# Altium schematic sheet Opamps.SchDoc
size A4; Author: Thomas Kreppel; CompanyName: Universidad de Santiago de Chile; Address1: Avenida Ecuador Nº 3519; Address2: Estación Central, Santiago; Address3: Chile; DocumentNumber: 5; SheetNumber: 5; SheetTotal: 10
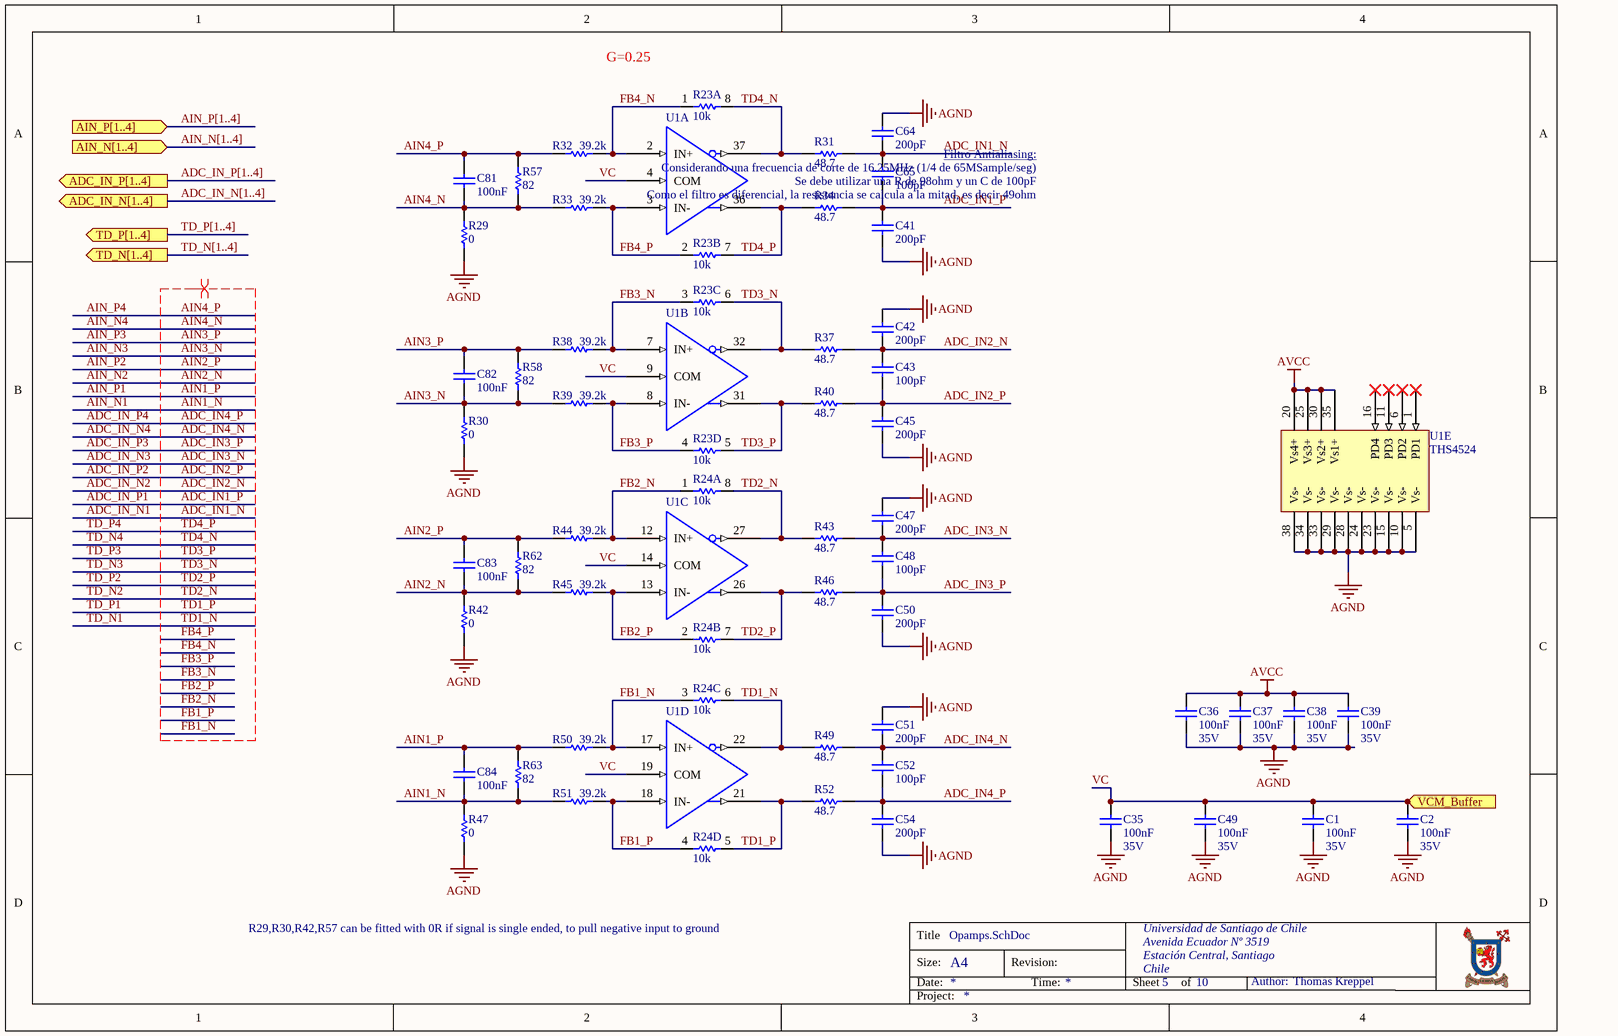
[diagram p0: Opamps.SchDoc]

## Parts
C1  100nF  Voltage: 35V  [CAP_0603]
C2  100nF  Voltage: 35V  [CAP_0603]
C35  100nF  Voltage: 35V  [CAP_0603]
C36  100nF  Voltage: 35V  [CAP_0603]
C37  100nF  Voltage: 35V  [CAP_0603]
C38  100nF  Voltage: 35V  [CAP_0603]
C39  100nF  Voltage: 35V  [CAP_0603]
C41  200pF  [CAP_0603]
C42  200pF  [CAP_0603]
C43  100pF  [CAP_0603]
C45  200pF  [CAP_0603]
C47  200pF  [CAP_0603]
C48  100pF  [CAP_0603]
C49  100nF  Voltage: 35V  [CAP_0603]
C50  200pF  [CAP_0603]
C51  200pF  [CAP_0603]
C52  100pF  [CAP_0603]
C54  200pF  [CAP_0603]
C64  200pF  [CAP_0603]
C65  100pF  [CAP_0603]
C81  100nF  [RES_1206]
C82  100nF  [RES_1206]
C83  100nF  [RES_1206]
C84  100nF  [RES_1206]
R23  10k  [CAC-80P320X160-8N]  (parts A,B,C,D of 4)
R24  10k  [CAC-80P320X160-8N]  (parts A,B,C,D of 4)
R29  0  [RES_0603]
R30  0  [RES_0603]
R31  48.7  [RES_0603]
R32  39.2k  [RES_0603]
R33  39.2k  [RES_0603]
R34  48.7  [RES_0603]
R37  48.7  [RES_0603]
R38  39.2k  [RES_0603]
R39  39.2k  [RES_0603]
R40  48.7  [RES_0603]
R42  0  [RES_0603]
R43  48.7  [RES_0603]
R44  39.2k  [RES_0603]
R45  39.2k  [RES_0603]
R46  48.7  [RES_0603]
R47  0  [RES_0603]
R49  48.7  [RES_0603]
R50  39.2k  [RES_0603]
R51  39.2k  [RES_0603]
R52  48.7  [RES_0603]
R57  82  [RES_1206]
R58  82  [RES_1206]
R62  82  [RES_1206]
R63  82  [RES_1206]
U1  THS4524  [THS4524 Footprint]  (value not drawn)  (parts A,B,C,D,E of 5)

## Ports
ADC_IN_N[1..4] (out), ADC_IN_P[1..4] (out), AIN_N[1..4] (in), AIN_P[1..4] (in), TD_N[1..4] (out), TD_P[1..4] (out), VCM_Buffer (in)

## Nets
AGND: C1.1 C2.1 C35.1 C36.2 C37.2 C38.2 C39.2 C41.2 C42.1 C45.2 C47.1 C49.1 C50.2 C51.1 C54.2 C64.1 R29.2 R30.2 R42.2 R47.2 U1.5(Vs-) U1.10(Vs-) U1.15(Vs-) U1.23(Vs-) U1.24(Vs-) U1.28(Vs-) U1.29(Vs-) U1.33(Vs-) U1.34(Vs-) U1.38(Vs-)
AVCC: C36.1 C37.1 C38.1 C39.1 U1.20(Vs4+) U1.25(Vs3+) U1.30(Vs2+) U1.35(Vs1+)
ADC_IN1_N: C64.2 C65.1 R31.1  [also labelled ADC_IN_N1]
ADC_IN1_P: C41.1 C65.2 R34.1  [also labelled ADC_IN_P1]
ADC_IN2_N: C42.2 C43.1 R37.1  [also labelled ADC_IN_N2]
ADC_IN2_P: C43.2 C45.1 R40.1  [also labelled ADC_IN_P2]
ADC_IN3_N: C47.2 C48.1 R43.1  [also labelled ADC_IN_N3]
ADC_IN3_P: C48.2 C50.1 R46.1  [also labelled ADC_IN_P3]
ADC_IN4_N: C51.2 C52.1 R49.1  [also labelled ADC_IN_N4]
ADC_IN4_P: C52.2 C54.1 R52.1  [also labelled ADC_IN_P4]
AIN1_N: C84.2 R47.1 R51.2 R63.2  [also labelled AIN_N1]
AIN1_P: C84.1 R50.2 R63.1  [also labelled AIN_P1]
AIN2_N: C83.2 R42.1 R45.2 R62.2  [also labelled AIN_N2]
AIN2_P: C83.1 R44.2 R62.1  [also labelled AIN_P2]
AIN3_N: C82.2 R30.1 R39.2 R58.2  [also labelled AIN_N3]
AIN3_P: C82.1 R38.2 R58.1  [also labelled AIN_P3]
AIN4_N: C81.2 R29.1 R33.2 R57.2  [also labelled AIN_N4]
AIN4_P: C81.1 R32.2 R57.1  [also labelled AIN_P4]
FB1_N: R24.3 R50.1 U1.17(IN+)
FB1_P: R24.4 R51.1 U1.18(IN-)
FB2_N: R24.1 R44.1 U1.12(IN+)
FB2_P: R24.2 R45.1 U1.13(IN-)
FB3_N: R23.3 R38.1 U1.7(IN+)
FB3_P: R23.4 R39.1 U1.8(IN-)
FB4_N: R23.1 R32.1 U1.2(IN+)
FB4_P: R23.2 R33.1 U1.3(IN-)
TD1_N: R24.6 R49.2 U1.22(OUT-)  [also labelled TD_N1]
TD1_P: R24.5 R52.2 U1.21(OUT+)  [also labelled TD_P1]
TD2_N: R24.8 R43.2 U1.27(OUT-)  [also labelled TD_N2]
TD2_P: R24.7 R46.2 U1.26(OUT+)  [also labelled TD_P2]
TD3_N: R23.6 R37.2 U1.32(OUT-)  [also labelled TD_N3]
TD3_P: R23.5 R40.2 U1.31(OUT+)  [also labelled TD_P3]
TD4_N: R23.8 R31.2 U1.37(OUT-)  [also labelled TD_N4]
TD4_P: R23.7 R34.2 U1.36(OUT+)  [also labelled TD_P4]
VC: C1.2 C2.2 C35.2 C49.2 U1.4(COM) U1.9(COM) U1.14(COM) U1.19(COM) ; port VCM_Buffer

Not connected (* = marked no-connect by the designer): U1 1(PD1)* 6(PD2)* 11(PD3)* 16(PD4)*

## Buses and harness runs
bus ADC_IN_N[1..4] = port ADC_IN_N[1..4]
bus ADC_IN_P[1..4] = port ADC_IN_P[1..4]
bus AIN_N[1..4] = port AIN_N[1..4]
bus AIN_P[1..4] = port AIN_P[1..4]
bus TD_N[1..4] = port TD_N[1..4]
bus TD_P[1..4] = port TD_P[1..4]

## Layout directives
differential pair: ADC_IN1_N, ADC_IN1_P, ADC_IN2_N, ADC_IN2_P, ADC_IN3_N, ADC_IN3_P, ADC_IN4_N, ADC_IN4_P, AIN1_N, AIN1_P, AIN2_N, AIN2_P, AIN3_N, AIN3_P, AIN4_N, AIN4_P, FB1_N, FB1_P, FB2_N, FB2_P, FB3_N, FB3_P, FB4_N, FB4_P, TD1_N, TD1_P, TD2_N, TD2_P, TD3_N, TD3_P, TD4_N, TD4_P

## Notes on the sheet
- G=0.25
- Considerando una frecuencia de corte de 16.25MHz (1/4 de 65MSample/seg)
- Se debe utilizar una R de 98ohm y un C de 100pF
- Filtro Antialiasing:
- Como el filtro es diferencial, la resistencia se calcula a la mitad, es decir 49ohm
- R29,R30,R42,R57 can be fitted with 0R if signal is single ended, to pull negative input to ground
- Title
- Size:
- Date:
- A4
- Revision:
- Time:
- Sheet
- of
- Author:
- Project:

## Library data of the parts
C1 C2 C35-C39 C49 = Cap_0603: Capacitor; MPN: C0603C104M5RACTU; Rule: PcbType=ProtelPcb; MF: KEMET; Dielectricum: X7R; Tolerance: 10%; Published: 8-Jun-2000; LatestRevisionDate: 17-Jul-2002; LatestRevisionNote: Re-released for DXP Platform.; PackageReference: RAD-0.3; Publisher: Altium Limited; Value: 100nF; Supplier 1: Digikey; Supplier 2: Mouser; Supplier Part Number 1: 399-7845-1-ND; Package: 0603
C41 C42 C45 C47 C50 C51 C54 C64 = Cap_0603: Capacitor; MPN: 0603N201J500CT; Rule: PcbType=ProtelPcb; MF: Walsin; Dielectricum: CG0; Tolerance: 5%; Voltage: 16V; Published: 8-Jun-2000; LatestRevisionDate: 17-Jul-2002; LatestRevisionNote: Re-released for DXP Platform.; PackageReference: RAD-0.3; Publisher: Altium Limited; Value: 200pF; Supplier 1: Digikey; Supplier 2: Mouser; Supplier Part Number 1: 1292-1499-1-ND; Package: 0603
C43 C48 C52 C65 = Cap_0603: Capacitor; MPN: 885012006023; Rule: PcbType=ProtelPcb; MF: Würth Elektronik; Dielectricum: CG0; Tolerance: 5%; Voltage: 16V; Published: 8-Jun-2000; LatestRevisionDate: 17-Jul-2002; LatestRevisionNote: Re-released for DXP Platform.; PackageReference: RAD-0.3; Publisher: Altium Limited; Value: 100pF; Supplier 1: Digikey; Supplier 2: Mouser; Supplier Part Number 1: 732-7766-1-ND; Package: 0603
C81-C84 = Cap_1206: Capacitor; Manufacturer Part-Number: C1206C104K3RACTU; Voltage: 25V; MF: KEMET; Dielectricum: X7R; Tolerance: 10%; Value: 100nF; Supplier 2: Mouser; Supplier 1: Digikey; Supplier Part Number 1: 399-8140-1-ND; Package: 1206
R23 R24 = ResArray 1206: Chip Resistor Array 0606, 4xR; Manufacturer: Vishay; Value: 10k; Created: Kreppel_0420; Supplier 1: Digikey; Supplier Part Number 1: 749-1023-1-ND; Supplier 2: Mouser
R29 R30 R42 R47 = Res0603: Manufacturer Part-Number: CRCW06030000Z0EA; Tolerance: 1%; Published: 8-Jun-2000; LatestRevisionDate: 17-Jul-2002; LatestRevisionNote: Re-released for DXP Platform.; PackageReference: AXIAL-0.3; Publisher: Altium Limited; PackageDescription: Axial Device, Thru-Hole; 2 Leads; 0.3 in Pin Spacing; Value: 0; Supplier 1: Digikey; Supplier 2: Mouser; Supplier Part Number 1: 541-0.0GCT-ND; Package: 0603
R31 R34 R37 R40 R43 R46 R49 R52 = Res0603: Manufacturer Part-Number: ERA-3AEB48R7V; Manufacturer 1: Panasonic; Tolerance: 0.1%; Published: 8-Jun-2000; LatestRevisionDate: 17-Jul-2002; LatestRevisionNote: Re-released for DXP Platform.; PackageReference: AXIAL-0.3; Publisher: Altium Limited; PackageDescription: Axial Device, Thru-Hole; 2 Leads; 0.3 in Pin Spacing; Value: 48.7; Supplier 1: Digikey; Supplier 2: Mouser; Supplier Part Number 1: P48.7DBCT-ND; Package: 0603
R32 R33 R38 R39 R44 R45 R50 R51 = Res0603: Manufacturer Part-Number: ERA-3AEB3922V; Tolerance: 0.1%; Published: 8-Jun-2000; LatestRevisionDate: 17-Jul-2002; LatestRevisionNote: Re-released for DXP Platform.; PackageReference: AXIAL-0.3; Publisher: Altium Limited; PackageDescription: Axial Device, Thru-Hole; 2 Leads; 0.3 in Pin Spacing; Value: 39.2k; Supplier 1: Digikey; Supplier 2: Mouser; Supplier Part Number 1: P39.2KDBCT-ND; Package: 0603
R57 R58 R62 R63 = Res Semi: Limiter Resistor; Manufacturer Part-Number: ERA-8AEB820V; Tolerance: 0.1%; Published: 8-Jun-2000; LatestRevisionDate: 17-Jul-2002; LatestRevisionNote: Re-released for DXP Platform.; PackageReference: AXIAL-0.5; Publisher: Altium Limited; PackageDescription: Axial Device, Thru-Hole; 2 Leads; 0.5 in Pin Spacing; Value: 82; Supplier 1: Digikey; Supplier 2: Mouser; Supplier Part Number 1: P82BCCT-ND; Package: 1206
U1 = THS4524_1: Quad Channel fully differential Amplilfier; Manufacturer: Texas Instruments; Created: 20190720_Kreppel; Package: TSSOP-38; Supplier 1: Digikey; Supplier Part Number 1: 296-24315-1-ND; Supplier 2: Mouser; Supplier Part Number 2: 595-THS4524IDBTR